# Altium schematic sheet Smart 4S and 5S switchable BMS [BQ769200].SchDoc (part 2 of 2)
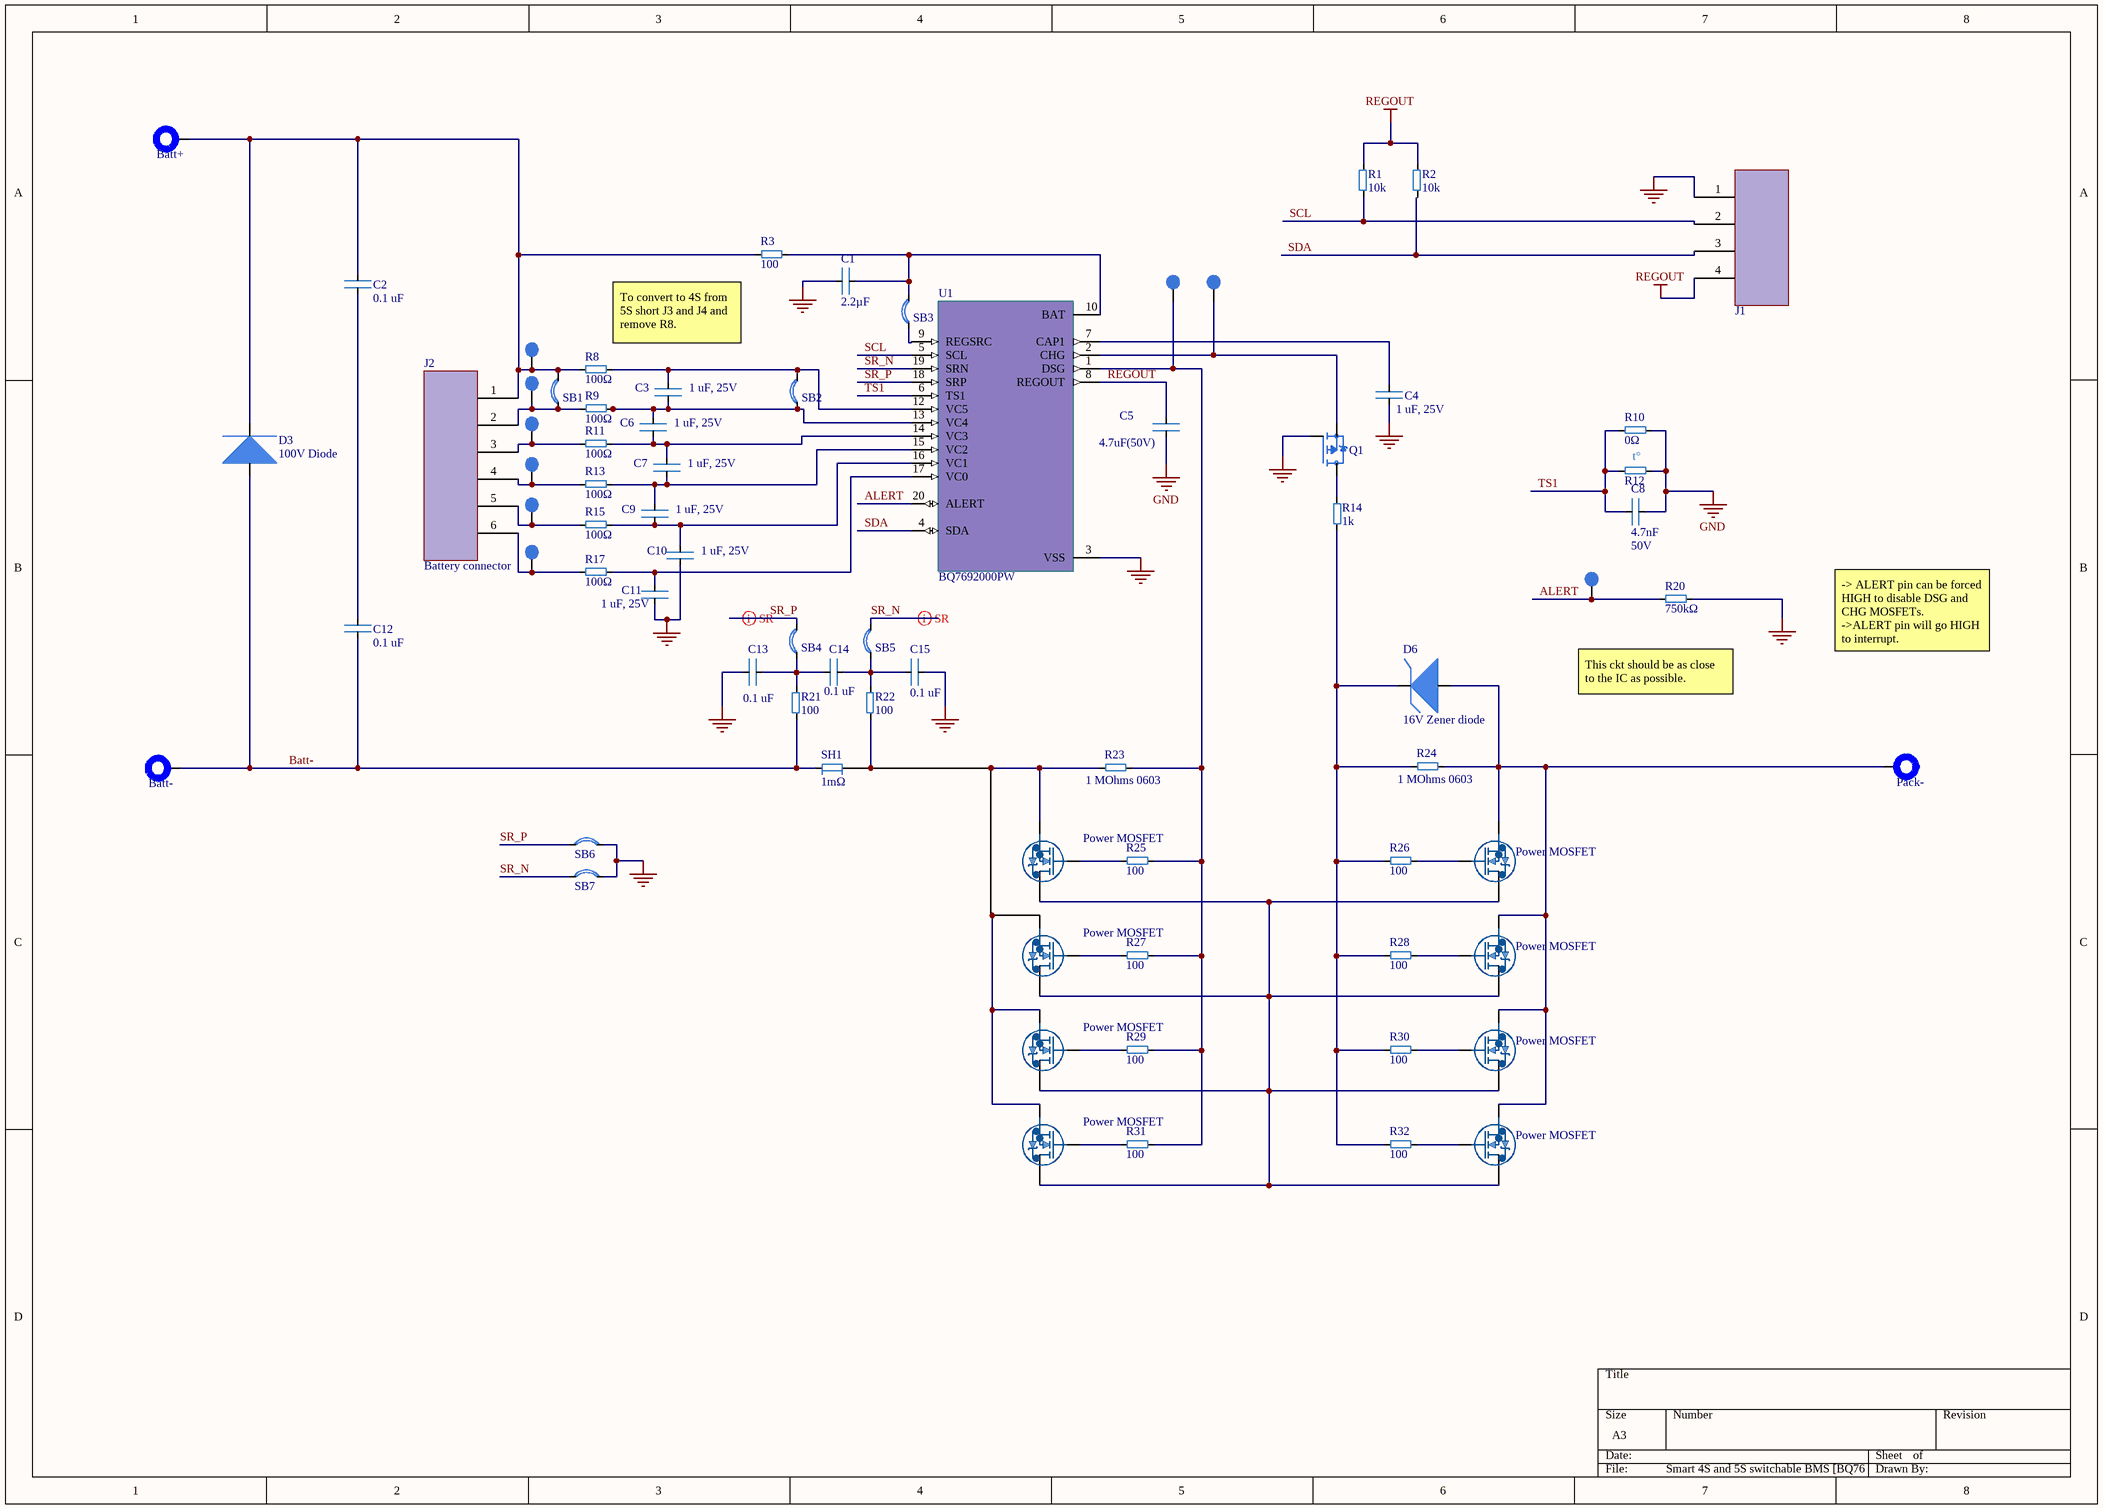
[diagram p1: Smart 4S and 5S switchable BMS [BQ769200].SchDoc]

## Library data of the parts
Batt+ = Batt+: Powerplus High Current Terminal; Manufacturer: Wurth Electronics; Manufacturer Part Number: S93515; Supplier: Digikey; Supplier Part Number: 2101-S93515-ND; RoHS: No; Category: Terminals; Stock: 33869; Pricing: 1=1.59, 10=1.352, 25=1.2668, 99=1.14929, 198=1.09439, 297=1.0635, 594=1.01273, 1089=0.97034, 2574=0.9375 (USD)
Batt- = Batt-: Powerplus High Current Terminal; Manufacturer: Wurth Electronics; Manufacturer Part Number: S93515; Supplier: Digikey; Supplier Part Number: 2101-S93515-ND; RoHS: No; Category: Terminals; Stock: 33869; Pricing: 1=1.59, 10=1.352, 25=1.2668, 99=1.14929, 198=1.09439, 297=1.0635, 594=1.01273, 1089=0.97034, 2574=0.9375 (USD)
C1 = 2.2uF(25V) 0805: Ceramic Capacitor, Ceramic, 25V, 10% +Tol, 10% -Tol, X7R, 15% TC, 2.2uF, Surface Mount, 0805; Manufacturer: Murata; Manufacturer Part Number: GCM21BR71E225KA73L; Manufacturer Lifecycle Status: IN PRODUCTION; Supplier: Arrow Electronics; Supplier Part Number: GCM21BR71E225KA73L; RoHS: Compliant; Category: Ceramic Capacitors; Stock: 2343000; Pricing: 3000=0.0515, 6000=0.05, 9000=0.046 (USD); Case/Package: 0805; Case Code (Imperial): 0805; Case Code (Metric): 2012; Depth: 1.25mm; Dielectric: X7R; Dielectric Material: Ceramic; Height: 1.25mm; Lead Free: Lead Free; Length: 2mm; Lifecycle Status: Production; Material: Ceramic; Max Operating Temperature: 125°C; Min Operating Temperature: -55°C; Mounting Technology: Surface Mount; Number of Terminals: 2; Packaging: Cut Tape; Radiation Hardening: No; Ratings: AEC-Q200; REACH SVHC: Yes; Schedule B: 8532240020, 8532240020|8532240020, 8532240020|8532240020|8532240020, 8532240020|8532240020|8532240020|8532240020; Termination: SMD/SMT; Tolerance: 10%; Voltage: 25V; Voltage Rating: 25V; Voltage Rating (DC): 25V; Width: 1.25mm; ComponentLink1URL: https://datasheet.octopart.com:443/GCM21BR71E225KA73L-Murata-datasheet-39128454.pdf?src-supplier=Newark; ComponentLink1Description: https://datasheet.octopart.com:443/GCM21BR71E225KA73L-Murata-datasheet-39128454.pdf?src-supplier=Newark; ComponentLink2URL: https://datasheet.octopart.com:443/GCM21BR71E225KA73L-Murata-datasheet-62316965.pdf?src-supplier=element14+APAC; ComponentLink2Description: https://datasheet.octopart.com:443/GCM21BR71E225KA73L-Murata-datasheet-62316965.pdf?src-supplier=element14+APAC; ComponentLink3URL: https://datasheet.octopart.com:443/GCM21BR71E225KA73L-Murata-datasheet-141268671.pdf?src-supplier=Geoflip; ComponentLink3Description: https://datasheet.octopart.com:443/GCM21BR71E225KA73L-Murata-datasheet-141268671.pdf?src-supplier=Geoflip; ComponentLink4URL: https://datasheet.octopart.com/GCM21BR71E225KA73L-Murata-datasheet-12524114.pdf; ComponentLink4Description: https://datasheet.octopart.com/GCM21BR71E225KA73L-Murata-datasheet-12524114.pdf; ComponentLink5URL: https://datasheet.octopart.com:443/GCM21BR71E225KA73L-Murata-datasheet-178519998.pdf?src-supplier=Arrow.cn; ComponentLink5Description: https://datasheet.octopart.com:443/GCM21BR71E225KA73L-Murata-datasheet-178519998.pdf?src-supplier=Arrow.cn; ComponentLink6URL: https://datasheet.octopart.com:443/GCM21BR71E225KA73L-Murata-datasheet-140660268.pdf?src-supplier=Ciiva; ComponentLink6Description: https://datasheet.octopart.com:443/GCM21BR71E225KA73L-Murata-datasheet-140660268.pdf?src-supplier=Ciiva; ComponentLink7URL: https://datasheet.octopart.com:443/GCM21BR71E225KA73L-Murata-datasheet-138719632.pdf?src-supplier=Ciiva; ComponentLink7Description: https://datasheet.octopart.com:443/GCM21BR71E225KA73L-Murata-datasheet-138719632.pdf?src-supplier=Ciiva; ComponentLink8URL: https://datasheet.octopart.com:443/GCM21BR71E225KA73L-Murata-datasheet-81857033.pdf?src-supplier=TME; ComponentLink8Description: https://datasheet.octopart.com:443/GCM21BR71E225KA73L-Murata-datasheet-81857033.pdf?src-supplier=TME; ComponentLink9URL: https://datasheet.octopart.com:443/GCM21BR71E225KA73L-Murata-datasheet-44104626.pdf?src-supplier=Future+Electronics; ComponentLink9Description: https://datasheet.octopart.com:443/GCM21BR71E225KA73L-Murata-datasheet-44104626.pdf?src-supplier=Future+Electronics; ComponentLink10URL: http://sigma.octopart.com:80/reach_statement/Murata-company-16.pdf?src-supplier=Compliance+Statements; ComponentLink10Description: http://sigma.octopart.com:80/reach_statement/Murata-company-16.pdf?src-supplier=Compliance+Statements
C2 C12-C15 = 0.1 uF 0805: Ceramic Capacitor, Multilayer, Ceramic, 50V, 5% +Tol, 5% -Tol, X7R, 15% TC, 0.1uF, Surface Mount, 0805; Manufacturer: Kyocera AVX; Manufacturer Part Number: 08055C104J4T2A; Value: 100nF; Multilayer: Yes; Reference Standard: AEC-Q200; Supplier: Mouser; Supplier Part Number: 581-08055C104J4T2A; RoHS: Yes; Category: Ceramic Capacitors; Stock: 13072; Pricing: 1=0.16, 10=0.088, 50=0.088, 100=0.056, 1000=0.039, 10000=0.026 (USD); Mounting Technology: Surface Mount; Pins: 2; Dielectric Material: Ceramic; Package Shape: Rectangular; Case/Package: 0805; Terminal Finish: Nickel; Min Operating Temperature: -55°C; Max Operating Temperature: 125°C; JESD-609 Code: e3; Capacitor Type: Ceramic; Tolerance  (fill in as +-): 5%; Package Style: SMTMeter; Packaging: Tape and Reel; Tolerance (fill in as +-): 5%; Rated DC Voltage (URdc): 50V; Temperature Characteristics Code: X7R; Termination: Wraparound; Length: 2.01mm; Width: 1.25mm; Height: 1.27mm; Reach SVHC Compliant: Yes; RoHS Compliant: Yes; ComponentLink1URL: https://datasheet.ciiva.com:443/pdfs/VipMasterIC/IC/AVXC/AVXC-S-A0009957027/AVXC-S-A0009957027-1.pdf?src-supplier=IHS+Markit; ComponentLink1Description: https://datasheet.ciiva.com:443/pdfs/VipMasterIC/IC/AVXC/AVXC-S-A0009957027/AVXC-S-A0009957027-1.pdf?src-supplier=IHS+Markit; ComponentLink2URL: https://datasheet.ciiva.com/45259/cauto-45259509.pdf?src-supplier=Digikey; ComponentLink2Description: https://datasheet.ciiva.com/45259/cauto-45259509.pdf?src-supplier=Digikey; ComponentLink3URL: https://datasheet.ciiva.com/11504/cauto-11504263.pdf?src-supplier=Avnet; ComponentLink3Description: https://datasheet.ciiva.com/11504/cauto-11504263.pdf?src-supplier=Avnet; ComponentLink4URL: https://datasheet.ciiva.com/5442/cauto-5442795.pdf?src-supplier=Mouser; ComponentLink4Description: https://datasheet.ciiva.com/5442/cauto-5442795.pdf?src-supplier=Mouser; ComponentLink5URL: https://datasheet.ciiva.com/46449/681197-46449293.pdf?src-supplier=Element14; ComponentLink5Description: https://datasheet.ciiva.com/46449/681197-46449293.pdf?src-supplier=Element14; ComponentLink6URL: https://datasheet.ciiva.com/7812/88813-7812350.pdf?src-supplier=Element14; ComponentLink6Description: https://datasheet.ciiva.com/7812/88813-7812350.pdf?src-supplier=Element14
C3 C4 C6 C7 C9-C11 = 1uF 0805: Ceramic Capacitor, Multilayer, Ceramic, 25V, 10% +Tol, 10% -Tol, X7R, 15% TC, 1uF, Surface Mount, 0805; Manufacturer: Kyocera AVX; Manufacturer Part Number: 08053C105K4Z4A; Multilayer: Yes; Reference Standard: AEC-Q200; Supplier: Avnet; Supplier Part Number: KAF21KR71E105KL; RoHS: Yes; Category: Ceramic Capacitors; Stock: 50000; Pricing: 10000=0.0468, 20000=0.046, 40000=0.0452, 60000=0.0444, 80000=0.0436 (USD); Mounting Technology: Surface Mount; Pins: 2; Dielectric Material: Ceramic; Package Shape: Rectangular; Case/Package: 0805; Terminal Finish: Nickel; Min Operating Temperature: -55°C; Max Operating Temperature: 125°C; JESD-609 Code: e3; Value: 1uF; Capacitor Type: Ceramic; Tolerance  (fill in as +-): 10%; Package Style: SMTMeter; Packaging: Tape and Reel; Tolerance (fill in as +-): 10%; Rated DC Voltage (URdc): 25V; Temperature Characteristics Code: X7R; Termination: Wraparound; Length: 2.01mm; Width: 1.25mm; Height: 1.4mm; Reach SVHC Compliant: Yes; RoHS Compliant: Yes; ComponentLink1URL: https://datasheet.ciiva.com:443/pdfs/VipMasterIC/IC/AVXC/AVXC-S-A0009957027/AVXC-S-A0009957027-1.pdf?src-supplier=IHS+Markit; ComponentLink1Description: https://datasheet.ciiva.com:443/pdfs/VipMasterIC/IC/AVXC/AVXC-S-A0009957027/AVXC-S-A0009957027-1.pdf?src-supplier=IHS+Markit; ComponentLink2URL: http://www.mouser.com/ds/2/40/AutoMLCC-777028.pdf?src-supplier=Mouser; ComponentLink2Description: http://www.mouser.com/ds/2/40/AutoMLCC-777028.pdf?src-supplier=Mouser; ComponentLink3URL: http://datasheets.avx.com/FlexitermMLCC.pdf?src-supplier=Digikey; ComponentLink3Description: http://datasheets.avx.com/FlexitermMLCC.pdf?src-supplier=Digikey; ComponentLink4URL: https://datasheet.octopart.com/08053C105K4Z4A-KYOCERA-AVX-datasheet-50865432.pdf?src-supplier=Future+Electronics; ComponentLink4Description: https://datasheet.octopart.com/08053C105K4Z4A-KYOCERA-AVX-datasheet-50865432.pdf?src-supplier=Future+Electronics; ComponentLink5URL: http://catalogs.avx.com/SurfaceMount.pdf?src-supplier=Digikey; ComponentLink5Description: http://catalogs.avx.com/SurfaceMount.pdf?src-supplier=Digikey
C5 = 4.7uF(50V) 0805: Ceramic Capacitor, Multilayer, Ceramic, 50V, 10% +Tol, 10% -Tol, X5R, 15% TC, 4.7uF, Surface Mount, 0805; Manufacturer: Murata; Manufacturer Part Number: GRM21BR61H475KE51L; Multilayer: Yes; Supplier: Mouser; Supplier Part Number: 81-GRM21BR61H475KE1L; RoHS: Yes; Category: Ceramic Capacitors; Stock: 51409; Pricing: 1=0.19, 10=0.108, 50=0.108, 100=0.068, 1000=0.051, 10000=0.034 (USD); Mounting Technology: Surface Mount; Pins: 2; Dielectric Material: Ceramic; Package Shape: Rectangular; Case/Package: 0805; Terminal Finish: Nickel; Min Operating Temperature: -55°C; Max Operating Temperature: 85°C; Termination: Wraparound; JESD-609 Code: e3; Value: 4.7uF; Capacitor Type: Ceramic; Tolerance  (fill in as +-): 10%; Package Style: SMTMeter; Packaging: Tape and Reel; Tolerance (fill in as +-): 10%; Rated DC Voltage (URdc): 50V; Temperature Characteristics Code: X5R; Length: 2mm; Width: 1.25mm; Height: 1.25mm; Reach SVHC Compliant: Yes; RoHS Compliant: Yes; ComponentLink1URL: https://datasheet.ciiva.com:443/pdfs/VipMasterIC/IC/MURE/MURE-S-A0004349797/MURE-S-A0004361460-1.pdf?src-supplier=IHS+Markit; ComponentLink1Description: https://datasheet.ciiva.com:443/pdfs/VipMasterIC/IC/MURE/MURE-S-A0004349797/MURE-S-A0004361460-1.pdf?src-supplier=IHS+Markit; ComponentLink2URL: http://www.farnell.com/datasheets/2079186.pdf?src-supplier=Farnell; ComponentLink2Description: http://www.farnell.com/datasheets/2079186.pdf?src-supplier=Farnell; ComponentLink3URL: https://datasheet.octopart.com/GRM21BR61H475KE51L-Murata-datasheet-22122223.pdf?src-supplier=Future+Electronics; ComponentLink3Description: https://datasheet.octopart.com/GRM21BR61H475KE51L-Murata-datasheet-22122223.pdf?src-supplier=Future+Electronics; ComponentLink4URL: http://www.farnell.com/datasheets/2079186.pdf?src-supplier=Element14; ComponentLink4Description: http://www.farnell.com/datasheets/2079186.pdf?src-supplier=Element14; ComponentLink5URL: https://datasheet.octopart.com/GRM21BR61H475KE51L-Murata-datasheet-66077112.pdf?src-supplier=Element14; ComponentLink5Description: https://datasheet.octopart.com/GRM21BR61H475KE51L-Murata-datasheet-66077112.pdf?src-supplier=Element14; ComponentLink6URL: http://search.murata.co.jp/Ceramy/image/img/A01X/G101/ENG/GRM21BR61H475KE51-01.pdf?src-supplier=Digikey; ComponentLink6Description: http://search.murata.co.jp/Ceramy/image/img/A01X/G101/ENG/GRM21BR61H475KE51-01.pdf?src-supplier=Digikey; ComponentLink7URL: https://search.murata.co.jp/Ceramy/image/img/A01X/G101/ENG/GRM21BR61H475KE51-01.pdf?src-supplier=Digikey; ComponentLink7Description: https://search.murata.co.jp/Ceramy/image/img/A01X/G101/ENG/GRM21BR61H475KE51-01.pdf?src-supplier=Digikey
C8 = 4700pF 0805: WCAP-CSGP 0805 (2012Metric) Ceramic Capacitor 0.079Lx0.049W 2.00mmx1.25mm X7R ±10% 4700pF; Manufacturer: Wurth Elektronik; Manufacturer Part Number: 885012207090; Insulation Resistance: 10GΩ; Supplier: DigiKey; Supplier Part Number: 732-8072-1-ND; RoHS: Compliant; Category: Ceramic Capacitors; Stock: 13537; Pricing: 1=0.1, 10=0.055, 50=0.0378, 100=0.0327, 500=0.02396, 1000=0.0213 (USD); Case/Package: 0805; Case Code (Imperial): 0805; Case Code (Metric): 2012; Height: 800µm; Length: 2mm; Material: Ceramic; Max Operating Temperature: 125°C; Min Operating Temperature: -55°C; Mounting Technology: Surface Mount; Thickness: 889µm; Tolerance: 10%; Voltage Rating: 50V; Width: 1.25mm; ComponentLink1URL: https://datasheet.octopart.com:443/885012207090-W%C3%BCrth-Elektronik-datasheet-137006526.pdf?src-supplier=Upverter; ComponentLink1Description: https://datasheet.octopart.com:443/885012207090-W%C3%BCrth-Elektronik-datasheet-137006526.pdf?src-supplier=Upverter; ComponentLink2URL: https://datasheet.octopart.com:443/885012207090-Wurth-Elektronik-datasheet-159617621.pdf?src-supplier=Newark; ComponentLink2Description: https://datasheet.octopart.com:443/885012207090-Wurth-Elektronik-datasheet-159617621.pdf?src-supplier=Newark; Parameter 1: *
D3 = 100V Diode: Diode Fast Recovery Diode 100V 0.5A 2-Pin TUMD T/R; Manufacturer: Rohm; Manufacturer Part Number: RF05VAM1STR; Average Rectified Current: 500mA; Reverse Recovery Time: 25ns; Max Surge Current: 6A; Recovery Time: 12ns; Forward Voltage: 820mV; Max Reverse Current: 10uA; Supplier: Mouser; Supplier Part Number: 755-RF05VAM1STR; RoHS: Yes; Category: Rectifier Diodes; Stock: 50105; Pricing: 1=0.24, 10=0.128, 50=0.128, 100=0.098, 1000=0.081, 10000=0.048 (USD); Mounting Technology: Surface Mount; Case/Package: SMD/SMT; Min Operating Temperature: -55°C; Max Operating Temperature: 150°C; Packaging: Tape and Reel; Forward Current: 500mA; Package Quantity: 3000; Max Reverse Voltage (DC): 100V; Series: -; RoHS Compliant: Yes; ComponentLink1URL: http://www.mouser.com/ds/2/348/rf05vam1s-520110.pdf?src-supplier=Mouser; ComponentLink1Description: http://www.mouser.com/ds/2/348/rf05vam1s-520110.pdf?src-supplier=Mouser; ComponentLink2URL: http://rohmfs.rohm.com/en/techdata_basic/diode/taping/Taping_TUMD2M_TR-e.pdf?src-supplier=Digikey; ComponentLink2Description: http://rohmfs.rohm.com/en/techdata_basic/diode/taping/Taping_TUMD2M_TR-e.pdf?src-supplier=Digikey; ComponentLink3URL: http://rohmfs.rohm.com/en/products/databook/datasheet/discrete/diode/fast_recovery/rf05vam1s.pdf?src-supplier=Digikey; ComponentLink3Description: http://rohmfs.rohm.com/en/products/databook/datasheet/discrete/diode/fast_recovery/rf05vam1s.pdf?src-supplier=Digikey; ComponentLink4URL: http://rohmfs.rohm.com/en/products/databook/datasheet/discrete/diode/fast_recovery/rf05vam1s.pdf?src-supplier=Avnet; ComponentLink4Description: http://rohmfs.rohm.com/en/products/databook/datasheet/discrete/diode/fast_recovery/rf05vam1s.pdf?src-supplier=Avnet
D6 = 16V Zener diode: Diode Zener Single 16V 5% 500mW Automotive 2-Pin SOD-123 T/R; Manufacturer: ON Semiconductor; Manufacturer Part Number: SZMMSZ5246BT1G; Supplier: Arrow Electronics; Supplier Part Number: SZMMSZ5246BT1G; RoHS: Yes; Category: Zener Diodes; Stock: 21000; Pricing: 1=0.126, 10=0.0807, 100=0.0626, 500=0.0611, 1000=0.0597, 3000=0.0399, 6000=0.0386 (USD); ComponentLink1URL: https://datasheet.ciiva.com/10638/mmsz5221bt1-d-10638284.pdf?src-supplier=Avnet; ComponentLink1Description: https://datasheet.ciiva.com/10638/mmsz5221bt1-d-10638284.pdf?src-supplier=Avnet; ComponentLink2URL: https://datasheet.ciiva.com/900/mmsz5221bt1-d-900242.pdf?src-supplier=Digikey; ComponentLink2Description: https://datasheet.ciiva.com/900/mmsz5221bt1-d-900242.pdf?src-supplier=Digikey
J1 = I2C port
J2 = Battery connector: WCAP-CSGP 0805 (2012Metric) Ceramic Capacitor 0.079Lx0.049W 2.00mmx1.25mm X7R ±10% 4700pF; Manufacturer: Wurth Elektronik; Manufacturer Part Number: 885012207090; Value: 4.7nF; Insulation Resistance: 10GΩ; Voltage Rating: 50V; Supplier: DigiKey; Supplier Part Number: 732-8072-1-ND; RoHS: Compliant; Category: Ceramic Capacitors; Stock: 13537; Pricing: 1=0.1, 10=0.055, 50=0.0378, 100=0.0327, 500=0.02396, 1000=0.0213 (USD); Case/Package: 0805; Case Code (Imperial): 0805; Case Code (Metric): 2012; Height: 800µm; Length: 2mm; Material: Ceramic; Max Operating Temperature: 125°C; Min Operating Temperature: -55°C; Mounting Technology: Surface Mount; Thickness: 889µm; Tolerance: 10%; Width: 1.25mm; ComponentLink1URL: https://datasheet.octopart.com:443/885012207090-W%C3%BCrth-Elektronik-datasheet-137006526.pdf?src-supplier=Upverter; ComponentLink1Description: https://datasheet.octopart.com:443/885012207090-W%C3%BCrth-Elektronik-datasheet-137006526.pdf?src-supplier=Upverter; ComponentLink2URL: https://datasheet.octopart.com:443/885012207090-Wurth-Elektronik-datasheet-159617621.pdf?src-supplier=Newark; ComponentLink2Description: https://datasheet.octopart.com:443/885012207090-Wurth-Elektronik-datasheet-159617621.pdf?src-supplier=Newark
Pack- = Pack-: Powerplus High Current Terminal; Manufacturer: Wurth Electronics; Manufacturer Part Number: S93515; Supplier: Digikey; Supplier Part Number: 2101-S93515-ND; RoHS: No; Category: Terminals; Stock: 33869; Pricing: 1=1.59, 10=1.352, 25=1.2668, 99=1.14929, 198=1.09439, 297=1.0635, 594=1.01273, 1089=0.97034, 2574=0.9375 (USD)
Q1 = P-CH 50V 130MA: P-Channel 50 V 10 Ohm Enhancement Mode Transistor SOT-323; Manufacturer: Diodes Inc.; Manufacturer Part Number: BSS84W-7-F; Continuous Drain Current (ID): 130mA; Current Rating: -130mA; Drain to Source Resistance: 10Ω; Drain to Source Voltage (Vdss): -50V; Element Configuration: Single; Gate to Source Voltage (Vgs): 20V; Input Capacitance: 45pF; Min Breakdown Voltage: 50V; Nominal Vgs: -1.6V; Number of Channels: 1; Value: 10Ω; Turn-Off Delay Time: 18ns; Turn-On Delay Time: 10ns; Supplier: Future Electronics; Supplier Part Number: 2191460; RoHS: Compliant; Category: MOSFETs; Stock: 1830000; Pricing: 3000=0.0295, 9000=0.0288, 15000=0.0285, 60000=0.0276, 90000=0.027 (USD); Case/Package: SOT-323; China RoHS: Compliant; Contact Plating: Tin; Height: 1mm; Lead Free: Lead Free; Length: 2.2mm; Lifecycle Status: Production; Max Operating Temperature: 150°C; Max Power Dissipation: 200mW; Min Operating Temperature: -55°C; Mounting Technology: Surface Mount; Number of Elements: 1; Pins: 3; Number of Terminals: 3; Power Dissipation: 200mW; Radiation Hardening: No; Rds On Max: 10Ω; REACH SVHC: Yes; Schedule B: 8541210080, 8541210080|8541210080, 8541210080|8541210080|8541210080, 8541210080|8541210080|8541210080|8541210080; Threshold Voltage: -1.6V; Voltage Rating (DC): -50V; Weight: 6.010099mg; Width: 1.35mm; ComponentLink1URL: https://datasheet.octopart.com:443/BSS84W-7-F-Diodes-Inc.-datasheet-180551845.pdf?src-supplier=Newark; ComponentLink1Description: https://datasheet.octopart.com:443/BSS84W-7-F-Diodes-Inc.-datasheet-180551845.pdf?src-supplier=Newark; ComponentLink2URL: https://datasheet.octopart.com:443/BSS84W-7-F-Diodes-Inc.-datasheet-12525918.pdf?src-supplier=Newark; ComponentLink2Description: https://datasheet.octopart.com:443/BSS84W-7-F-Diodes-Inc.-datasheet-12525918.pdf?src-supplier=Newark; ComponentLink3URL: https://datasheet.octopart.com:443/BSS84W-7-F-Diodes-Inc.-datasheet-8398566.pdf?src-supplier=Newark; ComponentLink3Description: https://datasheet.octopart.com:443/BSS84W-7-F-Diodes-Inc.-datasheet-8398566.pdf?src-supplier=Newark; ComponentLink4URL: https://datasheet.octopart.com:443/BSS84W-7-F-Diodes-Inc.-datasheet-41567332.pdf?src-supplier=Newark; ComponentLink4Description: https://datasheet.octopart.com:443/BSS84W-7-F-Diodes-Inc.-datasheet-41567332.pdf?src-supplier=Newark; ComponentLink5URL: https://datasheet.octopart.com:443/BSS84W-7-F-Diodes-Inc.-datasheet-116035940.pdf?src-supplier=Diodes+Inc+SCT; ComponentLink5Description: https://datasheet.octopart.com:443/BSS84W-7-F-Diodes-Inc.-datasheet-116035940.pdf?src-supplier=Diodes+Inc+SCT; ComponentLink6URL: https://sigma.octopart.com:443/138896157/technical_drawing/Diodes-Inc.-BSS84W-7-F.pdf?src-supplier=Diodes+Inc+SCT; ComponentLink6Description: https://sigma.octopart.com:443/138896157/technical_drawing/Diodes-Inc.-BSS84W-7-F.pdf?src-supplier=Diodes+Inc+SCT; ComponentLink7URL: https://datasheet.octopart.com:443/BSS84W-7-F-Diodes-Inc.-datasheet-128476779.pdf?src-supplier=TME; ComponentLink7Description: https://datasheet.octopart.com:443/BSS84W-7-F-Diodes-Inc.-datasheet-128476779.pdf?src-supplier=TME; ComponentLink8URL: https://datasheet.octopart.com:443/BSS84W-7-F-Diodes-Inc.-datasheet-14061317.pdf?src-supplier=iiiC; ComponentLink8Description: https://datasheet.octopart.com:443/BSS84W-7-F-Diodes-Inc.-datasheet-14061317.pdf?src-supplier=iiiC; ComponentLink9URL: https://datasheet.octopart.com:443/BSS84W-7-F-Diodes-Inc.-datasheet-41929731.pdf?src-supplier=RS+(Formerly+Allied+Electronics); ComponentLink9Description: https://datasheet.octopart.com:443/BSS84W-7-F-Diodes-Inc.-datasheet-41929731.pdf?src-supplier=RS+(Formerly+Allied+Electronics); ComponentLink10URL: https://datasheet.octopart.com:443/BSS84W-7-F-Diodes-Inc.-datasheet-8318221.pdf?src-supplier=Jameco; ComponentLink10Description: https://datasheet.octopart.com:443/BSS84W-7-F-Diodes-Inc.-datasheet-8318221.pdf?src-supplier=Jameco; ComponentLink11URL: https://datasheet.octopart.com:443/BSS84W-7-F-Diodes-Inc.-datasheet-71356.pdf?src-supplier=Mouser; ComponentLink11Description: https://datasheet.octopart.com:443/BSS84W-7-F-Diodes-Inc.-datasheet-71356.pdf?src-supplier=Mouser; ComponentLink12URL: http://sigma.octopart.com:80/15540767/rohs_statement/Diodes-Inc.-BSS84W-7-F.pdf?src-supplier=Compliance+Statements; ComponentLink12Description: http://sigma.octopart.com:80/15540767/rohs_statement/Diodes-Inc.-BSS84W-7-F.pdf?src-supplier=Compliance+Statements
Q2-Q9 = Power MOSFET: Mosfet, N-ch, Single, 120A, 65V,; Manufacturer: Good-Ark; Supplier: DigiKey; Supplier Part Number: 4786-GSFP06120CT-ND; Manufacturer Part Number: GSFP06120; Category: MOSFETs; Stock: 2771; Pricing: 1=0.93, 10=0.669, 25=0.6028, 100=0.5305, 250=0.49588, 500=0.47506, 1000=0.45792 (USD)
R1 R2 = 10 kOhms 0603: Fixed Resistor, Metal Glaze/thick Film, 0.1W, 10000ohm, 75V, 1% +/-Tol, 100ppm/Cel, Surface Mount, 0603; Manufacturer: Bourns; Manufacturer Part Number: CR0603-FX-1002ELF; Power: 100mW; Rated Temperature: 70°C; Value: 10kR; Working Voltage: 50V; Temperature Coefficient (ppm/Cel): 100; Package Height: 0.45mm; Package Length: 1.6mm; Package Width: 0.8mm; Supplier: Avnet; Supplier Part Number: CR0603-FX-1002ELF; RoHS: Yes; Category: Chip SMD Resistors; Stock: 95000; Pricing: 5000=0.00217, 10000=0.00213, 20000=0.0021, 30000=0.00207, 40000=0.00203 (USD); Mounting Technology: Surface Mount; Pins: 2; Package Shape: Rectangular; Case/Package: 0603; Terminal Finish: Nickel; Min Operating Temperature: -55°C; Max Operating Temperature: 155°C; Tolerance: 1%; Termination: Wraparound; JESD-609 Code: e3; Resistor Type: FIXED RESISTOR; Construction: Chip; Packaging: Tape and Reel; Technology: RUTHENIUM OXIDE; Reach SVHC Compliant: Yes; RoHS Compliant: Yes; ComponentLink1URL: https://datasheet.ciiva.com:443/pdfs/VipMasterIC/IC/BOUR/BOUR-S-A0009069624/BOUR-S-A0009069624-1.pdf?src-supplier=IHS+Markit; ComponentLink1Description: https://datasheet.ciiva.com:443/pdfs/VipMasterIC/IC/BOUR/BOUR-S-A0009069624/BOUR-S-A0009069624-1.pdf?src-supplier=IHS+Markit; ComponentLink2URL: https://datasheet.ciiva.com/11808/0900766b80fcdb72-11808032.pdf?src-supplier=Rs; ComponentLink2Description: https://datasheet.ciiva.com/11808/0900766b80fcdb72-11808032.pdf?src-supplier=Rs; ComponentLink3URL: https://datasheet.ciiva.com/27049/774903-27049975.pdf?src-supplier=Jameco; ComponentLink3Description: https://datasheet.ciiva.com/27049/774903-27049975.pdf?src-supplier=Jameco; ComponentLink4URL: https://datasheet.ciiva.com/22644/1849498-22644171.pdf?src-supplier=Element14; ComponentLink4Description: https://datasheet.ciiva.com/22644/1849498-22644171.pdf?src-supplier=Element14; ComponentLink5URL: https://datasheet.ciiva.com/22693/1902866-22693206.pdf?src-supplier=Element14; ComponentLink5Description: https://datasheet.ciiva.com/22693/1902866-22693206.pdf?src-supplier=Element14; ComponentLink6URL: https://datasheet.ciiva.com/5548/chpreztr-5548911.pdf?src-supplier=Mouser; ComponentLink6Description: https://datasheet.ciiva.com/5548/chpreztr-5548911.pdf?src-supplier=Mouser; ComponentLink7URL: https://datasheet.ciiva.com/16757/70154685-16757483.pdf?src-supplier=Allied+Electronics; ComponentLink7Description: https://datasheet.ciiva.com/16757/70154685-16757483.pdf?src-supplier=Allied+Electronics; ComponentLink8URL: https://datasheet.ciiva.com/3255/chpreztr-3255918.pdf?src-supplier=Avnet; ComponentLink8Description: https://datasheet.ciiva.com/3255/chpreztr-3255918.pdf?src-supplier=Avnet; ComponentLink9URL: https://datasheet.ciiva.com/7001/1902866-7001623.pdf?src-supplier=Newark; ComponentLink9Description: https://datasheet.ciiva.com/7001/1902866-7001623.pdf?src-supplier=Newark
R3 R21 R22 R25-R32 = 100 Ohms 0603: Fixed Resistor, Metal Glaze/thick Film, 0.1W, 100ohm, 75V, 1% +/-Tol, 100ppm/Cel, Surface Mount, 0603; Manufacturer: Bourns; Manufacturer Part Number: CR0603-FX-1000ELF; Power: 100mW; Rated Temperature: 70°C; Value: 100R; Working Voltage: 50V; Package Height: 0.45mm; Package Length: 1.6mm; Package Width: 0.8mm; Supplier: Avnet; Supplier Part Number: CR0603-FX-1000ELF; RoHS: Yes; Category: Chip SMD Resistors; Stock: 30000; Pricing: 5000=0.00217, 10000=0.00213, 20000=0.0021, 30000=0.00207, 40000=0.00203 (USD); Mounting Technology: Surface Mount; Pins: 2; Package Shape: Rectangular; Case/Package: 0603; Terminal Finish: Nickel; Min Operating Temperature: -55°C; Max Operating Temperature: 155°C; Tolerance: 1%; JESD-609 Code: e3; Resistor Type: FIXED RESISTOR; Construction: Chip; Packaging: Tape and Reel; Technology: RUTHENIUM OXIDE; Termination: Wraparound; Temperature Coefficient (ppm/Cel): 100; Reach SVHC Compliant: Yes; RoHS Compliant: Yes; ComponentLink1URL: https://datasheet.ciiva.com:443/pdfs/VipMasterIC/IC/BOUR/BOUR-S-A0009069624/BOUR-S-A0009069624-1.pdf?src-supplier=IHS+Markit; ComponentLink1Description: https://datasheet.ciiva.com:443/pdfs/VipMasterIC/IC/BOUR/BOUR-S-A0009069624/BOUR-S-A0009069624-1.pdf?src-supplier=IHS+Markit; ComponentLink2URL: https://datasheet.ciiva.com/11808/0900766b80fcdb72-11808031.pdf?src-supplier=Rs; ComponentLink2Description: https://datasheet.ciiva.com/11808/0900766b80fcdb72-11808031.pdf?src-supplier=Rs; ComponentLink3URL: https://datasheet.ciiva.com/41449/001055482-da-01-en-smd-wid-cr0603-fx-1000elf-100-ohm-1-10w-41449966.pdf?src-supplier=Conrad; ComponentLink3Description: https://datasheet.ciiva.com/41449/001055482-da-01-en-smd-wid-cr0603-fx-1000elf-100-ohm-1-10w-41449966.pdf?src-supplier=Conrad; ComponentLink4URL: https://datasheet.ciiva.com/7001/1902866-7001621.pdf?src-supplier=Newark; ComponentLink4Description: https://datasheet.ciiva.com/7001/1902866-7001621.pdf?src-supplier=Newark; ComponentLink5URL: https://datasheet.ciiva.com/31841/159chpreztr-31841547.pdf?src-supplier=Onlinecomponents.com; ComponentLink5Description: https://datasheet.ciiva.com/31841/159chpreztr-31841547.pdf?src-supplier=Onlinecomponents.com; ComponentLink6URL: https://datasheet.ciiva.com/7986/691949-7986155.pdf?src-supplier=Element14; ComponentLink6Description: https://datasheet.ciiva.com/7986/691949-7986155.pdf?src-supplier=Element14; ComponentLink7URL: https://datasheet.ciiva.com/6564/chpreztr-6564376.pdf?src-supplier=Digikey; ComponentLink7Description: https://datasheet.ciiva.com/6564/chpreztr-6564376.pdf?src-supplier=Digikey; ComponentLink8URL: https://datasheet.ciiva.com/6564/chpreztr-6564377.pdf?src-supplier=Digikey; ComponentLink8Description: https://datasheet.ciiva.com/6564/chpreztr-6564377.pdf?src-supplier=Digikey; ComponentLink9URL: https://datasheet.ciiva.com/6564/chpreztr-6564375.pdf?src-supplier=Digikey; ComponentLink9Description: https://datasheet.ciiva.com/6564/chpreztr-6564375.pdf?src-supplier=Digikey
R8 R9 R11 R13 R15 R17 = 100 Ohms 1206: Res Thick Film 1206 100 Ohm 1% 0.5W(1/2W) ±100ppm/C Pad SMD T/R; Manufacturer: Bourns; Manufacturer Part Number: CRM1206-FX-1000ELF; Max Power Dissipation: 500mW; Temperature Coefficient: 100ppm/°C; Working Voltage: 200V; Supplier: Avnet; Supplier Part Number: 34AK1227; RoHS: Compliant; Category: Chip SMD Resistors; Stock: 13169; Pricing: 1=0.198, 25=0.066, 50=0.053, 100=0.041 (USD); Case/Package: 1206; China RoHS: Non-Compliant; Composition: Thick Film; Height: 550µm; Length: 3.0988mm; Lifecycle Status: Production; Max Operating Temperature: 155°C; Min Operating Temperature: -55°C; Mounting Technology: Surface Mount; Number of Terminals: 2; Number of Terminations: 2; Packaging: Tape & Reel (TR); Power Dissipation: 500mW; REACH SVHC: Yes; Schedule B: 8533210045, 8533210045|8533210045|8533210045|8533210045|8533210045; Tolerance: 1%; Width: 1.6mm; ComponentLink1URL: https://datasheet.octopart.com:443/CRM1206-FX-1000ELF-Bourns-datasheet-182141858.pdf?src-supplier=Master+Electronics; ComponentLink1Description: https://datasheet.octopart.com:443/CRM1206-FX-1000ELF-Bourns-datasheet-182141858.pdf?src-supplier=Master+Electronics; ComponentLink2URL: https://datasheet.octopart.com:443/CRM1206-FX-1000ELF-Bourns-datasheet-68302004.pdf?src-supplier=Master+Electronics; ComponentLink2Description: https://datasheet.octopart.com:443/CRM1206-FX-1000ELF-Bourns-datasheet-68302004.pdf?src-supplier=Master+Electronics; ComponentLink3URL: https://datasheet.octopart.com:443/CRM1206-FX-1000ELF-Bourns-datasheet-164353756.pdf?src-supplier=element14+APAC; ComponentLink3Description: https://datasheet.octopart.com:443/CRM1206-FX-1000ELF-Bourns-datasheet-164353756.pdf?src-supplier=element14+APAC; ComponentLink4URL: https://datasheet.octopart.com:443/CRM1206-FX-1000ELF-Bourns-datasheet-154729671.pdf?src-supplier=Electro+Sonic; ComponentLink4Description: https://datasheet.octopart.com:443/CRM1206-FX-1000ELF-Bourns-datasheet-154729671.pdf?src-supplier=Electro+Sonic; ComponentLink5URL: https://datasheet.octopart.com:443/CRM1206-FX-1000ELF-Bourns-datasheet-137068308.pdf?src-supplier=X-ON; ComponentLink5Description: https://datasheet.octopart.com:443/CRM1206-FX-1000ELF-Bourns-datasheet-137068308.pdf?src-supplier=X-ON; ComponentLink6URL: https://datasheet.octopart.com:443/CRM1206-FX-1000ELF-Bourns-datasheet-97424573.pdf?src-supplier=Burklin+Elektronik; ComponentLink6Description: https://datasheet.octopart.com:443/CRM1206-FX-1000ELF-Bourns-datasheet-97424573.pdf?src-supplier=Burklin+Elektronik; ComponentLink7URL: http://sigma.octopart.com:80/conflict_mineral_statement/Bourns-company-36.pdf?src-supplier=Compliance+Statements; ComponentLink7Description: http://sigma.octopart.com:80/conflict_mineral_statement/Bourns-company-36.pdf?src-supplier=Compliance+Statements
R10 = 0 Ohms 0603: Res Metal Plate 0603 0 Ohm Pad SMD T/R Automotive; Manufacturer: Stackpole Electronics; Manufacturer Part Number: HCJ0603ZT0R00; Power Dissipation: 250mW; Supplier: Avnet; Supplier Part Number: HCJ0603ZT0R00; RoHS: Compliant; Category: Chip SMD Resistors; Stock: 155000; Pricing: 5000=0.07857, 10000=0.07432, 20000=0.07237, 40000=0.07051, 80000=0.06875 (USD); Case/Package: 0603; Case Code (Imperial): 0603; Case Code (Metric): 1608; Height: 500µm; Length: 1.5494mm; Lifecycle Status: Production; Max Operating Temperature: 155°C; Min Operating Temperature: -55°C; Mounting Technology: Surface Mount; Number of Terminals: 2; Number of Terminations: 2; Packaging: Tape & Reel (TR); Power Rating: 250mW; Radiation Hardening: No; REACH SVHC: Yes; Schedule B: 8533210045, 8533210045|8533210045, 8533210045|8533210045|8533210045, 8533210045|8533210045|8533210045|8533210045; Termination: Wraparound; Width: 800µm; ComponentLink1URL: https://datasheet.octopart.com:443/HCJ0603ZT0R00-Stackpole-Electronics-datasheet-170576570.pdf?src-supplier=IHS; ComponentLink1Description: https://datasheet.octopart.com:443/HCJ0603ZT0R00-Stackpole-Electronics-datasheet-170576570.pdf?src-supplier=IHS; ComponentLink2URL: https://datasheet.octopart.com:443/HCJ0603ZT0R00-Stackpole-Electronics-datasheet-56871323.pdf?src-supplier=Upverter; ComponentLink2Description: https://datasheet.octopart.com:443/HCJ0603ZT0R00-Stackpole-Electronics-datasheet-56871323.pdf?src-supplier=Upverter; ComponentLink3URL: https://datasheet.octopart.com:443/HCJ0603ZT0R00-Stackpole-Electronics-datasheet-189104157.pdf?src-supplier=Master+Electronics; ComponentLink3Description: https://datasheet.octopart.com:443/HCJ0603ZT0R00-Stackpole-Electronics-datasheet-189104157.pdf?src-supplier=Master+Electronics; ComponentLink4URL: https://datasheet.octopart.com:443/HCJ0603ZT0R00-Stackpole-Electronics-datasheet-141193803.pdf?src-supplier=Stackpole+Electronics; ComponentLink4Description: https://datasheet.octopart.com:443/HCJ0603ZT0R00-Stackpole-Electronics-datasheet-141193803.pdf?src-supplier=Stackpole+Electronics; ComponentLink5URL: https://datasheet.octopart.com:443/HCJ0603ZT0R00-Stackpole-Electronics-datasheet-45185688.pdf?src-supplier=Stackpole+Electronics; ComponentLink5Description: https://datasheet.octopart.com:443/HCJ0603ZT0R00-Stackpole-Electronics-datasheet-45185688.pdf?src-supplier=Stackpole+Electronics; ComponentLink6URL: https://datasheet.octopart.com:443/HCJ0603ZT0R00-Stackpole-Electronics-datasheet-156956881.pdf?src-supplier=Electro+Sonic; ComponentLink6Description: https://datasheet.octopart.com:443/HCJ0603ZT0R00-Stackpole-Electronics-datasheet-156956881.pdf?src-supplier=Electro+Sonic; ComponentLink7URL: http://sigma.octopart.com:80/141158211/reach_statement/Stackpole-Electronics-HCJ0603ZT0R00.pdf?src-supplier=Compliance+Statements; ComponentLink7Description: http://sigma.octopart.com:80/141158211/reach_statement/Stackpole-Electronics-HCJ0603ZT0R00.pdf?src-supplier=Compliance+Statements; ComponentLink8URL: http://sigma.octopart.com:80/141158212/rohs_statement/Stackpole-Electronics-HCJ0603ZT0R00.pdf?src-supplier=Compliance+Statements; ComponentLink8Description: http://sigma.octopart.com:80/141158212/rohs_statement/Stackpole-Electronics-HCJ0603ZT0R00.pdf?src-supplier=Compliance+Statements
R12 = 10kOhms 103AT-2 NTC Thermistor: NTC Thermistor, 10000ohm, Through Hole Mount; Manufacturer: Semitec; Power Dissipation: 10mW; Value: 10kΩ; Tolerance: 1%; Supplier: Mouser; Supplier Part Number: 954-103AT-2; Manufacturer Part Number: 103AT-2; RoHS: Compliant; Category: Thermistors; Stock: 17162; Pricing: 1=0.58, 10=0.545, 50=0.485, 100=0.462, 1000=0.4, 10000=0.366 (USD); Case/Package: Radial; Height: 4mm; Lead Pitch: 2.54mm; Length: 17mm; Lifecycle Status: Production; Max Operating Temperature: 110°C; Min Operating Temperature: -50°C; Pins: 2; Number of Terminals: 2; Packaging: Bulk; Power Rating: 10mW; Termination: Radial; Width: 2.4mm; ComponentLink1URL: https://datasheet.octopart.com:443/103AT-2-Semitec-datasheet-182147832.pdf?src-supplier=IHS; ComponentLink1Description: https://datasheet.octopart.com:443/103AT-2-Semitec-datasheet-182147832.pdf?src-supplier=IHS; ComponentLink2URL: https://datasheet.octopart.com:443/103AT-2-Semitec-datasheet-151884368.pdf?src-supplier=Upverter; ComponentLink2Description: https://datasheet.octopart.com:443/103AT-2-Semitec-datasheet-151884368.pdf?src-supplier=Upverter
R14 = 1 kOhms 0603: Fixed Resistor, Metal Glaze/thick Film, 0.1W, 1000ohm, 75V, 5% +/-Tol, 200ppm/Cel, Surface Mount, 0603; Manufacturer: Bourns; Manufacturer Part Number: CR0603-JW-102ELF; Power: 100mW; Rated Temperature: 70°C; Value: 1kR; Working Voltage: 50V; Temperature Coefficient (ppm/Cel): 200; Package Height: 0.45mm; Package Length: 1.6mm; Package Width: 0.8mm; Supplier: Avnet; Supplier Part Number: CR0603-JW-102ELF; RoHS: Yes; Category: Chip SMD Resistors; Stock: 15000; Pricing: 5000=0.00196, 10000=0.00195, 20000=0.00194, 30000=0.00193, 40000=0.00192 (USD); Mounting Technology: Surface Mount; Pins: 2; Package Shape: Rectangular; Case/Package: 0603; Terminal Finish: Nickel; Min Operating Temperature: -55°C; Max Operating Temperature: 155°C; Tolerance: 5%; JESD-609 Code: e3; Resistor Type: FIXED RESISTOR; Construction: Chip; Packaging: Tape and Reel; Technology: RUTHENIUM OXIDE; Termination: Wraparound; Reach SVHC Compliant: Yes; RoHS Compliant: Yes; ComponentLink1URL: https://datasheet.ciiva.com:443/pdfs/VipMasterIC/IC/BOUR/BOUR-S-A0009069624/BOUR-S-A0009069624-1.pdf?src-supplier=IHS+Markit; ComponentLink1Description: https://datasheet.ciiva.com:443/pdfs/VipMasterIC/IC/BOUR/BOUR-S-A0009069624/BOUR-S-A0009069624-1.pdf?src-supplier=IHS+Markit; ComponentLink2URL: https://datasheet.ciiva.com/7986/1902866-7986188.pdf?src-supplier=Element14; ComponentLink2Description: https://datasheet.ciiva.com/7986/1902866-7986188.pdf?src-supplier=Element14; ComponentLink3URL: https://datasheet.ciiva.com/46383/691949-46383788.pdf?src-supplier=Element14; ComponentLink3Description: https://datasheet.ciiva.com/46383/691949-46383788.pdf?src-supplier=Element14; ComponentLink4URL: https://datasheet.ciiva.com/16757/70154685-16757477.pdf?src-supplier=Allied+Electronics; ComponentLink4Description: https://datasheet.ciiva.com/16757/70154685-16757477.pdf?src-supplier=Allied+Electronics; ComponentLink5URL: https://datasheet.ciiva.com/9123/chpreztr-9123706.pdf?src-supplier=Avnet; ComponentLink5Description: https://datasheet.ciiva.com/9123/chpreztr-9123706.pdf?src-supplier=Avnet; ComponentLink6URL: https://datasheet.ciiva.com/6564/chpreztr-6564439.pdf?src-supplier=Digikey; ComponentLink6Description: https://datasheet.ciiva.com/6564/chpreztr-6564439.pdf?src-supplier=Digikey; ComponentLink7URL: https://datasheet.ciiva.com/6564/chpreztr-6564441.pdf?src-supplier=Digikey; ComponentLink7Description: https://datasheet.ciiva.com/6564/chpreztr-6564441.pdf?src-supplier=Digikey
R20 = 750 kOhms 0603: Res Thick Film 0603 750K Ohm 1% 1/10W ±100ppm/°C Molded SMD Punched Carrier T/R; Manufacturer: Panasonic; Manufacturer Part Number: ERJ-3EKF7503V; Max Power Dissipation: 100mW; Voltage Rating: 75V; Supplier: Arrow Electronics; Supplier Part Number: ERJ-3EKF7503V; RoHS: Compliant; Category: Chip SMD Resistors; Stock: 45236; Pricing: 1=0.057, 10=0.012, 25=0.012, 100=0.007, 250=0.007, 500=0.006, 1000=0.005, 3000=0.005, 6000=0.004, 15000=0.004, 30000=0.003 (USD); Case/Package: 0603; Case Code (Imperial): 0603; China RoHS: Non-Compliant; Composition: Thick Film; Contact Plating: Tin; Depth: 800µm; Features: Automotive AEC-Q200; Height: 450µm; Lead Free: Lead Free; Length: 1.6mm; Lifecycle Status: Production; Max Operating Temperature: 155°C; Military Standard: Not; Min Operating Temperature: -55°C; Mounting Technology: Surface Mount; Number of Terminals: 2; Number of Terminations: 2; Packaging: Cut Tape; Power Dissipation: 100mW; Power Rating: 100mW; Radiation Hardening: No; REACH SVHC: Yes; Schedule B: 8533210045, 8533210045|8533210045, 8533210045|8533210045|8533210045, 8533210045|8533210045|8533210045|8533210045; Temperature Coefficient: 100ppm/°C; Termination: SMD/SMT; Tolerance: 1%; Width: 800µm; Working Voltage: 75V; ComponentLink1URL: https://datasheet.octopart.com:443/ERJ3EKF7503V-Panasonic-datasheet-182147282.pdf?src-supplier=IHS; ComponentLink1Description: https://datasheet.octopart.com:443/ERJ3EKF7503V-Panasonic-datasheet-182147282.pdf?src-supplier=IHS; ComponentLink2URL: https://datasheet.octopart.com:443/ERJ-3EKF7503V-Panasonic-datasheet-13266541.pdf?src-supplier=RS+(Formerly+Allied+Electronics); ComponentLink2Description: https://datasheet.octopart.com:443/ERJ-3EKF7503V-Panasonic-datasheet-13266541.pdf?src-supplier=RS+(Formerly+Allied+Electronics); ComponentLink3URL: https://datasheet.octopart.com:443/ERJ-3EKF7503V-Panasonic-datasheet-48891056.pdf?src-supplier=Newark; ComponentLink3Description: https://datasheet.octopart.com:443/ERJ-3EKF7503V-Panasonic-datasheet-48891056.pdf?src-supplier=Newark; ComponentLink4URL: https://datasheet.octopart.com:443/ERJ-3EKF7503V-Panasonic-datasheet-168681906.pdf?src-supplier=Farnell; ComponentLink4Description: https://datasheet.octopart.com:443/ERJ-3EKF7503V-Panasonic-datasheet-168681906.pdf?src-supplier=Farnell; ComponentLink5URL: https://datasheet.octopart.com:443/ERJ-3EKF7503V-Panasonic-datasheet-136608610.pdf?src-supplier=Farnell; ComponentLink5Description: https://datasheet.octopart.com:443/ERJ-3EKF7503V-Panasonic-datasheet-136608610.pdf?src-supplier=Farnell; ComponentLink6URL: https://datasheet.octopart.com:443/ERJ-3EKF7503V-Panasonic---ECG-datasheet-10025800.pdf?src-supplier=Farnell; ComponentLink6Description: https://datasheet.octopart.com:443/ERJ-3EKF7503V-Panasonic---ECG-datasheet-10025800.pdf?src-supplier=Farnell; ComponentLink7URL: https://datasheet.octopart.com:443/ERJ-3EKF7503V-Panasonic---ECG-datasheet-8853621.pdf?src-supplier=Farnell; ComponentLink7Description: https://datasheet.octopart.com:443/ERJ-3EKF7503V-Panasonic---ECG-datasheet-8853621.pdf?src-supplier=Farnell; ComponentLink8URL: https://datasheet.octopart.com:443/ERJ-3EKF7503V-Panasonic---ECG-datasheet-15994758.pdf?src-supplier=Farnell; ComponentLink8Description: https://datasheet.octopart.com:443/ERJ-3EKF7503V-Panasonic---ECG-datasheet-15994758.pdf?src-supplier=Farnell; ComponentLink9URL: https://datasheet.octopart.com:443/ERJ-3EKF7503V-Panasonic-datasheet-5313456.pdf?src-supplier=element14+APAC; ComponentLink9Description: https://datasheet.octopart.com:443/ERJ-3EKF7503V-Panasonic-datasheet-5313456.pdf?src-supplier=element14+APAC; ComponentLink10URL: https://datasheet.octopart.com:443/ERJ-3EKF7503V-Panasonic-datasheet-154766169.pdf?src-supplier=Master+Electronics; ComponentLink10Description: https://datasheet.octopart.com:443/ERJ-3EKF7503V-Panasonic-datasheet-154766169.pdf?src-supplier=Master+Electronics; ComponentLink11URL: https://datasheet.octopart.com:443/ERJ3EKF7503V-Panasonic-datasheet-138819429.pdf?src-supplier=Burklin+Elektronik; ComponentLink11Description: https://datasheet.octopart.com:443/ERJ3EKF7503V-Panasonic-datasheet-138819429.pdf?src-supplier=Burklin+Elektronik; ComponentLink12URL: https://datasheet.octopart.com:443/ERJ-3EKF7503V-Panasonic-datasheet-82288794.pdf?src-supplier=Panasonic+SCT; ComponentLink12Description: https://datasheet.octopart.com:443/ERJ-3EKF7503V-Panasonic-datasheet-82288794.pdf?src-supplier=Panasonic+SCT; ComponentLink13URL: https://datasheet.octopart.com/ERJ-3EKF7503V-Panasonic-datasheet-78375410.pdf; ComponentLink13Description: https://datasheet.octopart.com/ERJ-3EKF7503V-Panasonic-datasheet-78375410.pdf; ComponentLink14URL: https://datasheet.octopart.com:443/ERJ-3EKF7503V-Panasonic-datasheet-118621.pdf?src-supplier=DigiKey; ComponentLink14Description: https://datasheet.octopart.com:443/ERJ-3EKF7503V-Panasonic-datasheet-118621.pdf?src-supplier=DigiKey; ComponentLink15URL: https://datasheet.octopart.com:443/ERJ-3EKF7503V-Panasonic-datasheet-41391857.pdf?src-supplier=Electro+Sonic; ComponentLink15Description: https://datasheet.octopart.com:443/ERJ-3EKF7503V-Panasonic-datasheet-41391857.pdf?src-supplier=Electro+Sonic; ComponentLink16URL: https://datasheet.octopart.com:443/ERJ-3EKF7503V-Panasonic-datasheet-38423196.pdf?src-supplier=Future+Electronics; ComponentLink16Description: https://datasheet.octopart.com:443/ERJ-3EKF7503V-Panasonic-datasheet-38423196.pdf?src-supplier=Future+Electronics
R23 R24 = 1 MOhms 0603: Res Thick Film 0603 1M Ohm 1% 1/10W ±100ppm/°C Molded SMD Paper T/R; Manufacturer: Yageo; Manufacturer Part Number: RC0603FR-071ML; Voltage Rating: 75V; Value: 1MR; Power Rating: 100mW; Application(s): HIGH RELIABILITY; Supplier: Future Electronics; Supplier Part Number: 2912863; RoHS: Yes; Category: Chip SMD Resistors; Stock: 1005000; Pricing: 5000=0.0009, 50000=0.0008, 150000=0.0008, 375000=0.0008, 1000000=0.0008 (USD); Case Code (Imperial): 0603; Case Code (Metric): 1608; Weight: 0.000847oz; Min Operating Temperature: -55°C; Max Operating Temperature: 155°C; Tolerance: 1%; Packaging: Cut Tape; Termination: SMD/SMT; Temperature Coefficient: 100ppm/°C; Package Quantity: 5000; Type: General Purpose; Series: RC; Technology: THICK FILM; Diameter: 10mm; Length: 1.6mm; Width: 0.8mm; Height: 0.45mm; Lead Pitch: 5mm; Radiation Hardening: 5898YesNo; RoHS Compliant: Yes; Lead Free: 5697LeadFree; ComponentLink1URL: https://datasheet.ciiva.com/11819/0900766b80f96399-11819295.pdf?src-supplier=Rs; ComponentLink1Description: https://datasheet.ciiva.com/11819/0900766b80f96399-11819295.pdf?src-supplier=Rs; ComponentLink2URL: https://datasheet.ciiva.com/7983/443971-7983614.pdf?src-supplier=Element14; ComponentLink2Description: https://datasheet.ciiva.com/7983/443971-7983614.pdf?src-supplier=Element14; ComponentLink3URL: https://datasheet.ciiva.com/12555/rc0603-272842-12555388.pdf?src-supplier=Mouser; ComponentLink3Description: https://datasheet.ciiva.com/12555/rc0603-272842-12555388.pdf?src-supplier=Mouser
SH1 = 1mOhms CSR: Res Metal Strip 2818 0.001 Ohm 1% 10W ±200ppm/C Pad SMD Automotive T/R; Manufacturer: Vishay; Manufacturer Part Number: WSHP28181L000FEB; Temperature Coefficient: 200ppm/°C; Working Voltage: 100mV; Supplier: Avnet; Supplier Part Number: WSHP28181L000FEA; RoHS: Compliant; Category: Chip SMD Resistors; Stock: 3500; Pricing: 3500=1.04104, 7000=1.00048, 14000=0.95992, 21000=0.91936, 28000=0.90246 (USD); Case/Package: 2818; Composition: Metal Element; Height: 1.5mm; Lifecycle Status: Production; Max Operating Temperature: 170°C; Min Operating Temperature: -65°C; Mounting Technology: Surface Mount; Number of Terminals: 2; Packaging: Bulk; Power Dissipation: 10W; Power Rating: 10W; Schedule B: 8533210045, 8533210045|8533210045|8533210045|8533210045|8533210045|8533210045|8533210045|8533210045|8533210045|8533210045|8533210045|8533210045|8533210045|8533210045|8533210045|8533210045|8533210045|8533210045|8533210045|8533210045|8533210045|8533210045|8533210045|85; Tolerance: 1%; Width: 4.6mm; ComponentLink1URL: https://datasheet.octopart.com:443/WSHP28181L000FEB-Vishay-datasheet-175423646.pdf?src-supplier=IHS; ComponentLink1Description: https://datasheet.octopart.com:443/WSHP28181L000FEB-Vishay-datasheet-175423646.pdf?src-supplier=IHS; ComponentLink2URL: https://datasheet.octopart.com:443/WSHP28181L000FEB-Vishay-datasheet-169394530.pdf?src-supplier=IHS; ComponentLink2Description: https://datasheet.octopart.com:443/WSHP28181L000FEB-Vishay-datasheet-169394530.pdf?src-supplier=IHS; ComponentLink3URL: https://datasheet.octopart.com:443/WSHP28181L000FEA-Vishay-datasheet-104525430.pdf?src-supplier=Upverter; ComponentLink3Description: https://datasheet.octopart.com:443/WSHP28181L000FEA-Vishay-datasheet-104525430.pdf?src-supplier=Upverter; ComponentLink4URL: https://datasheet.octopart.com:443/WSHP28181L000FEB-Vishay-datasheet-76801956.pdf?src-supplier=element14+APAC; ComponentLink4Description: https://datasheet.octopart.com:443/WSHP28181L000FEB-Vishay-datasheet-76801956.pdf?src-supplier=element14+APAC; ComponentLink5URL: http://sigma.octopart.com:80/rohs_statement/Vishay-company-15.pdf?src-supplier=Compliance+Statements; ComponentLink5Description: http://sigma.octopart.com:80/rohs_statement/Vishay-company-15.pdf?src-supplier=Compliance+Statements
TP5 TP6 TP17 = Test Point
U1 = BQ7692000PW: 3 to 5-Series Cell Li-Ion and Li-Phosphate Battery Monitor (bq76940 Family) 20-TSSOP -40 to 85; MF: Texas Instruments; MP: BQ7692000PW; Availability: Warning; SnapEDA_Link: https://www.snapeda.com/parts/BQ7692000PW/Texas%20Instruments/view-part/533751/?ref=snap; Check_prices: https://www.snapeda.com/parts/BQ7692000PW/Texas%20Instruments/view-part/533751/?ref=eda; Value: *; Purchase-URL: https://pricing.snapeda.com/search/part/BQ7692000PW/?ref=eda; Package: TSSOP-20 Texas Instruments; Price: None